# EAGLE design NES_IO_US (EAGLE 7.5.0)
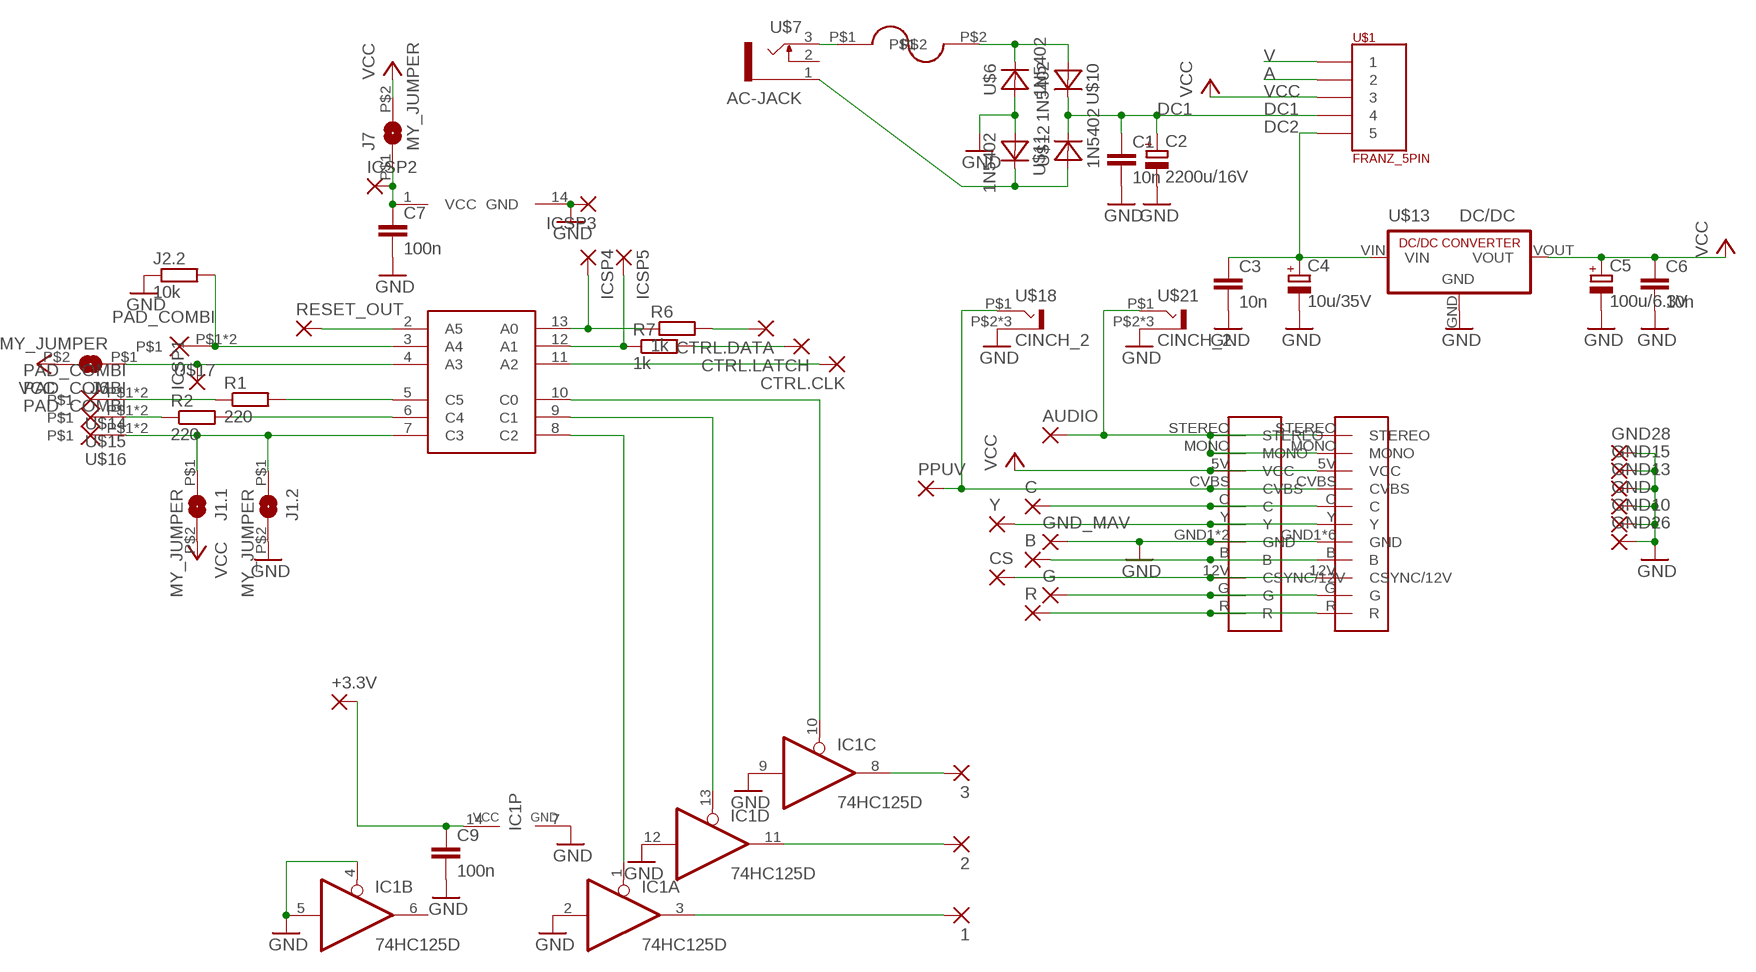
[diagram p0: schematic, sheet 1]

## Parts
1  SMD2  [SMD1,27-2,54]
2  SMD2  [SMD1,27-2,54]
3  SMD2  [SMD1,27-2,54]
+3.3V  SMD2  [SMD1,27-2,54]
AUDIO  SMD2  [SMD1,27-2,54]
B  SMD2  [SMD1,27-2,54]
C  SMD2  [SMD1,27-2,54]
C1  10n  C0805  [Z0805]
C2  2200u/16V  CPOL-EUE5-13  [E5-13]
C3  10n  C0805  [Z0805]
C4  10u/35V  CPOL-EUB  [PANASONIC_B]
C5  100u/6.3V  CPOL-EUD  [PANASONIC_D]
C6  10n  C0805  [Z0805]
C7  100n  C0805  [Z0805]
C9  100n  C0805  [Z0805]
CS  SMD2  [SMD1,27-2,54]
CTRL.CLK  SMD2  [SMD1,27-2,54]
CTRL.DATA  SMD2  [SMD1,27-2,54]
CTRL.LATCH  SMD2  [SMD1,27-2,54]
G  SMD2  [SMD1,27-2,54]
GND  SMD5  [SMD2,54-5,08]
GND10  SMD5  [SMD2,54-5,08]
GND13  SMD5  [SMD2,54-5,08]
GND15  SMD5  [SMD2,54-5,08]
GND26  SMD5  [SMD2,54-5,08]
GND28  SMD5  [SMD2,54-5,08]
GND_MAV  SMD2  [SMD1,27-2,54]
IC1  74HC125D  [SO14]
ICSP1  1,6/0,8  [1,6/0,8]
ICSP2  1,6/0,8  [1,6/0,8]
ICSP3  1,6/0,8  [1,6/0,8]
ICSP4  1,6/0,8  [1,6/0,8]
ICSP5  1,6/0,8  [1,6/0,8]
J1.1  MY_JUMPER  [MYJUMP]
J1.2  MY_JUMPER  [MYJUMP]
J2.2  10k  R0805  [Z0805]
J6  MY_JUMPER  [MYJUMP]
J7  MY_JUMPER  [MYJUMP]
PPUV  SMD2  [SMD1,27-2,54]
R  SMD2  [SMD1,27-2,54]
R1  220  R0805  [Z0805]
R2  220  R0805  [Z0805]
R6  1k  R0805  [Z0805]
R7  1k  R0805  [Z0805]
RESET_OUT  SMD2  [SMD1,27-2,54]
U$1  FRANZ_5PIN  [5X2.22RM4]
U$2  FUSEHOLDER  [FUSEHOLDER]
U$5  PIC16F630_SIMPLE  [PIC16F630]
U$6  1N5402  [DO201]
U$7  AC-JACK  [AC-JACK]
U$10  1N5402  [DO201]
U$11  1N5402  [DO201]
U$12  1N5402  [DO201]
U$13  DC/DC  [RECOM]
U$14  PAD_COMBI  [PAD_COMBI]
U$15  PAD_COMBI  [PAD_COMBI]
U$16  PAD_COMBI  [PAD_COMBI]
U$17  PAD_COMBI  [PAD_COMBI]
U$18  CINCH_2  [CINCH_2]
U$19  GC-MULTIAV  [GC-MULTIAV]
U$20  SNES-MULTIAV2  [SNES-MULTIAV2]
U$21  CINCH_2  [CINCH_2]
Y  SMD2  [SMD1,27-2,54]

## Nets
A: U$1.P$2
AC1A: U$2.P$1 U$7.3
AC1B: U$2.P$2 U$6.C U$10.A
AC2: U$7.1 U$11.C U$12.A
DC1: C1.1 C2.+ U$1.P$4 U$10.C U$12.C
DC2: C3.1 C4.+ U$1.P$5 U$13.VIN
GND: C1.2 C2.- C3.2 C4.- C5.- C6.2 C7.2 C9.2 GND10.1(P) GND13.1(P) GND15.1(P) GND26.1(P) GND28.1(P) GND.1(P) GND_MAV.1(P) IC1.2(A:I) IC1.4(B:OE) IC1.5(B:I) IC1.7(P:GND) IC1.9(C:I) IC1.12(D:I) ICSP3.1(P) J1.2.P$2 J2.2.1 U$5.14(GND) U$6.A U$11.A U$13.GND U$18.P$2(S) U$18.P$3(S) U$18.P$4(S) U$19.GND1(GND) U$19.GND2(GND) U$19.GND3(GND) U$19.GND4(GND) U$19.GND5(GND) U$19.GND6(GND) U$20.GND1(GND) U$20.GND2(GND) U$21.P$2(S) U$21.P$3(S) U$21.P$4(S)
N$1: CS.1(P) U$19.12V(CSYNC/12V) U$20.12V(CSYNC/12V)
N$2: U$19.Y U$20.Y Y.1(P)
N$3: C.1(P) U$19.C U$20.C
N$5: AUDIO.1(P) U$19.MONO U$19.STEREO U$20.MONO U$20.STEREO U$21.P$1(T)
N$6: B.1(P) U$19.B U$20.B
N$8: G.1(P) U$19.G U$20.G
N$9: R.1(P) U$19.R U$20.R
N$11: 3.1(P) IC1.8(C:O)
N$12: J2.2.2 U$5.3(A4) U$17.P$1 U$17.P$2
N$13: R1.2 U$5.5(C5)
N$14: R2.2 U$5.6(C4)
N$15: R1.1 U$14.P$1 U$14.P$2
N$16: R2.1 U$15.P$1 U$15.P$2
N$17: J1.1.P$1 J1.2.P$1 U$5.7(C3) U$16.P$1 U$16.P$2
N$19: CTRL.DATA.1(P) R6.2
N$20: CTRL.LATCH.1(P) R7.2
N$21: CTRL.CLK.1(P) U$5.11(A2)
N$23: IC1.10(C:OE) U$5.10(C0)
N$24: IC1.13(D:OE) U$5.9(C1)
N$25: IC1.1(A:OE) U$5.8(C2)
N$26: +3.3V.1(P) C9.1 IC1.14(P:VCC)
N$27: 1.1(P) IC1.3(A:O)
N$28: 2.1(P) IC1.11(D:O)
N$30: PPUV.1(P) U$18.P$1(T) U$19.CVBS U$20.CVBS
N$31: C7.1 ICSP2.1(P) J7.P$1 U$5.1(VCC)
N$32: ICSP1.1(P) J6.P$1 U$5.4(A3)
N$33: ICSP4.1(P) R6.1 U$5.13(A0)
N$34: ICSP5.1(P) R7.1 U$5.12(A1)
N$35: RESET_OUT.1(P) U$5.2(A5)
V: U$1.P$1
VCC: C5.+ C6.1 J1.1.P$2 J6.P$2 J7.P$2 U$1.P$3 U$13.VOUT U$19.5V(VCC) U$20.5V(VCC)
Unconnected: IC1.6(B:O) U$7.2

## Library data of the parts
1-3 +3.3V AUDIO B C CS CTRL.CLK CTRL.DATA CTRL.LATCH G GND_MAV PPUV R RESET_OUT Y = wirepad:SMD2: SMD PAD
C1 C3 C6 C7 C9 = snes_div:C0805
C2 = resistor:CPOL-EU: POLARIZED CAPACITOR, European symbol
C4 C5 = rcl:CPOL-EU: POLARIZED CAPACITOR, European symbol
GND GND10 GND13 GND15 GND26 GND28 = wirepad:SMD5: SMD PAD
IC1 = 74xx-eu:74*125: Quad bus BUFFER, 3-state
ICSP1-ICSP5 = wirepad:1,6/0,8: THROUGH-HOLE PAD
J1.1 J1.2 J6 J7 = snes_div:MY_JUMPER
J2.2 R1 R2 R6 R7 = snes_div:R0805
U$1 = schnaustlib:FRANZ_5PIN
U$2 = nintendo:FUSEHOLDER
U$5 = snes_div:PIC16F630_SIMPLE
U$6 U$10-U$12 = nintendo:1N5402
U$7 = nintendo:AC-JACK
U$13 = nintendo:DC/DC
U$14-U$17 = MS_Mod:PAD_COMBI
U$18 U$21 = nintendo:CINCH_2
U$19 = nintendo:GC-MULTIAV
U$20 = nintendo:SNES-MULTIAV2

## Board
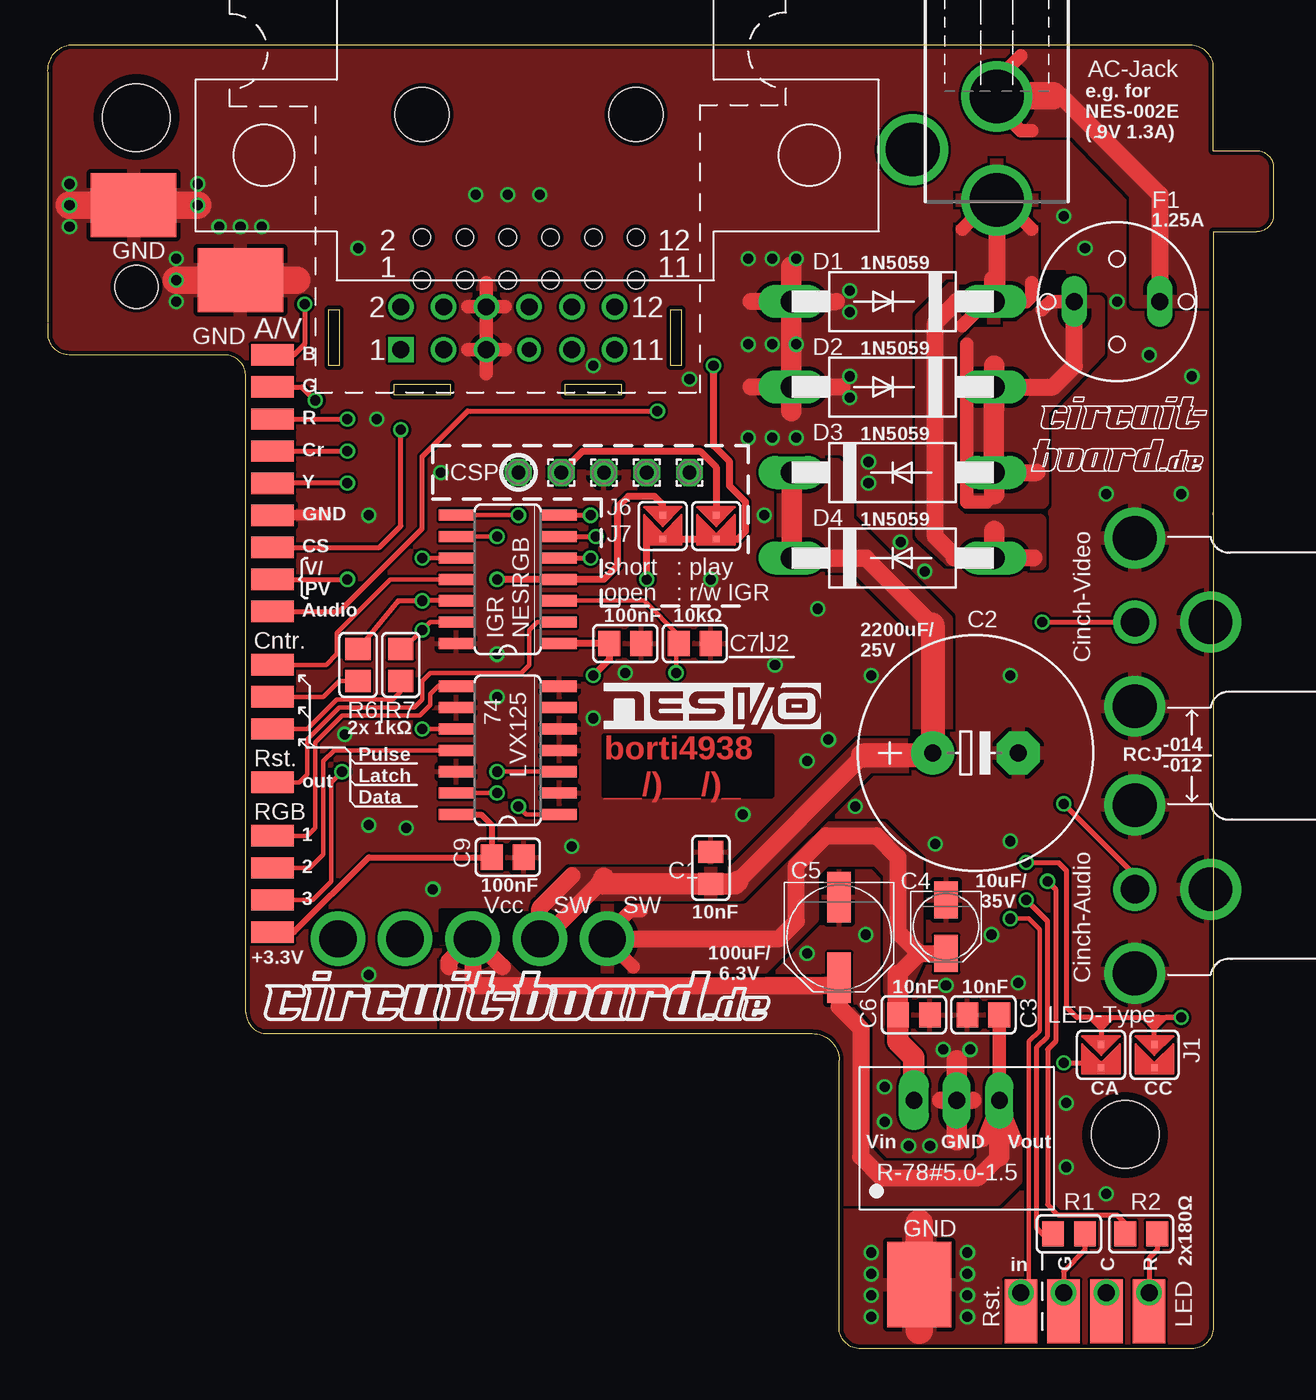
[diagram p1: board, top side]
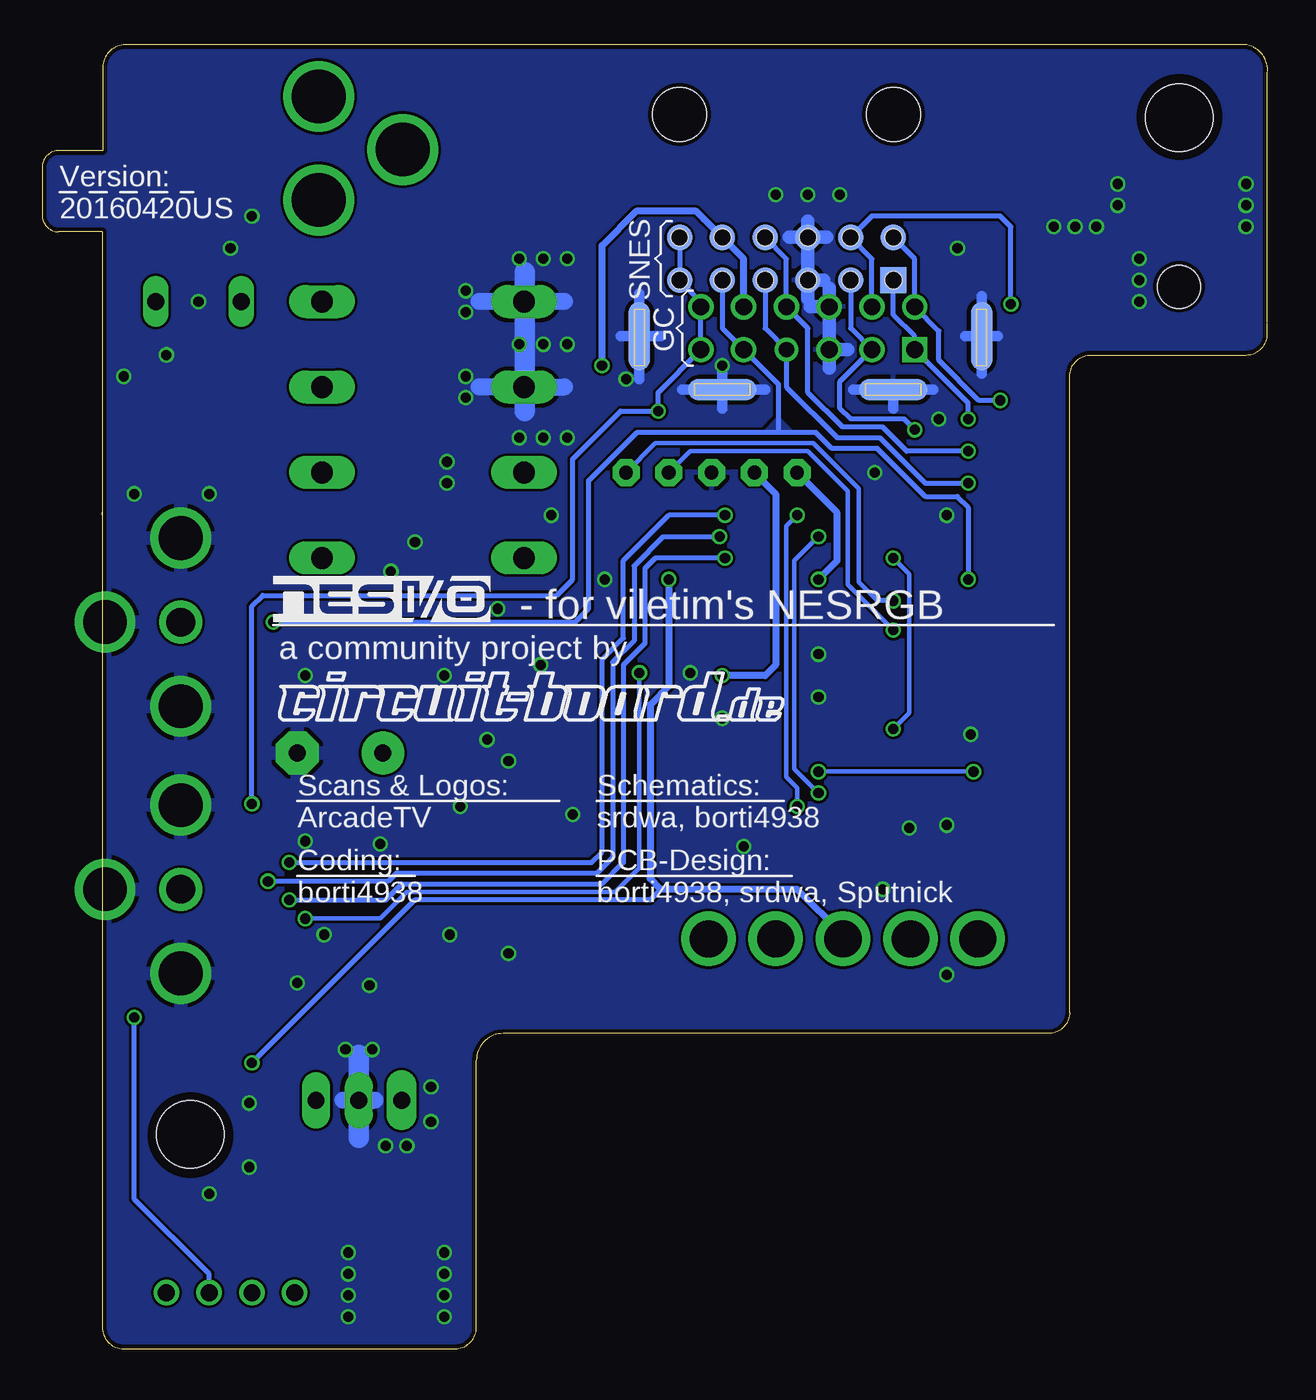
[diagram p2: board, bottom side, seen from below]

Size 72.8 x 77.5 mm. Coordinates in mm from the lower left corner, seen from the top.
Outline: 69.22,49.69 69.22,66.37 71.8,66.37 arc90 72.8,67.37 72.8,70.2 arc90 71.8,71.2 69.2,71.2 69.2,76.13 arc90 67.84,77.5 1.37,77.5 arc90 0.01,75.81 0.01,61.01
Outline: 69.22,49.69 69.22,49.53
Outline: 0.01,60.96 0.01,60.33 arc90 1.28,59.05 10.49,59.05 arc-90 11.76,57.78 11.76,20 arc90 13.03,18.73 45.41,18.73 arc-90 47,17.14 47,1.27 arc90 48.27,0 67.95,0 arc90 69.22,1.27 69.22,49.53
Outline: 69.22,49.53 arc-7 69.22,49.69
Copper layers (1*16): Top 0.035mm / dielectric 1.5mm / Bottom 0.035mm
Design rules "ITEADstudio_DRC": minimum track width 6mil, minimum drill 12mil, track to track 6mil, track to pad 6mil, pad to pad 6mil, via to via 6mil, smd to smd 0mil, copper to edge 10mil, drill to drill 10mil, minimum pad ring 10mil, minimum via ring 6mil, stop-mask expansion 2mil, vias tented up to drill 30mil, thermal gap 10mil
Holes 4 mm at 5.26,73.16 63.99,12.73
Holes 2.54 mm at 5.26,63.11
tRestrict: area 62,10.7 to 66,14.7; area 3.2,71.2 to 7.3,75.2; area 23.3,24.1 to 28.1,26; area 31.4,52.4 to 34.8,53.3; area 12.1,24.3 to 14.6,59.7; area 59.1,62.5 to 60.3,64; area 57.3,13.3 to 58.6,20.6
bRestrict: area 62,10.7 to 66,14.7; area 3.2,71.2 to 7.3,75.2; area 31.4,52.4 to 34.8,53.3

### Footprints (pad centres in the part's own frame; a part is rotated, then mirrored left to right if it is on the bottom)
SMD1,27-2,54 = smd 1.27 x 2.54: 1 0,0
Z0805 = smd 1.3 x 1.5: 1 -0.95,0; 2 0.95,0
E5-13 = drill 1.016 pad 2.54: + -2.54,0 | drill 1.016 pad 2.54 octagon: - 2.54,0
PANASONIC_B = smd 2.2 x 1.4: + 1.6,0; - -1.6,0
PANASONIC_D = smd 3 x 1.4: + 2.4,0; - -2.4,0
SMD2,54-5,08 = smd 2.54 x 5.08: 1 0,0
SO14 = smd 0.66 x 2.032: 1 -3.81,-3.073; 2 -2.54,-3.073; 3 -1.27,-3.073; 4 0,-3.073; 5 1.27,-3.073; 6 2.54,-3.073; 7 3.81,-3.073; 8 3.81,3.073; 9 2.54,3.073; 10 1.27,3.073; 11 0,3.073; 12 -1.27,3.073; 13 -2.54,3.073; 14 -3.81,3.073
1,6/0,8 = drill 0.813 pad 1.6 octagon: 1 0,0
MYJUMP = smd 0.406 x 0.406: P$1 -0.635,0; P$2 0.765,0
5X2.22RM4 = drill 2.22: P$1 -8,0; P$2 -4,0; P$3 0,0; P$4 4,0; P$5 8,0
FUSEHOLDER = drill 1 pad 1.422 long: P$1 -2.54,0; P$2 2.54,0
PIC16F630 = smd 0.66 x 2.032: 1 -3.81,-3.073; 2 -2.54,-3.073; 3 -1.27,-3.073; 4 0,-3.073; 5 1.27,-3.073; 6 2.54,-3.073; 7 3.81,-3.073; 8 3.81,3.073; 9 2.54,3.073; 10 1.27,3.073; 11 0,3.073; 12 -1.27,3.073; 13 -2.54,3.073; 14 -3.81,3.073
DO201 = drill 1.3 long: A 6,0; C -6,0
AC-JACK = drill 3.2 pad 4: 1 0,8.57; 2 5,5.57; 3 0,2.42
RECOM = drill 1 pad 1.676 long: GND 0,0; VOUT 2.54,0 | drill 1 pad 1.778 long: VIN -2.54,0
PAD_COMBI = smd 1.93 x 3.81: P$1 0,0 | drill 1: P$2 0,1.111
CINCH_2 = drill 1.7: P$1 0,-4.5 | drill 2.6: P$2 -5,-4.5; P$3 5,-4.5; P$4 0,0
GC-MULTIAV = drill 1: 5V 15.24,5.08; 12V 7.62,2.54; B 7.62,5.08; C 12.7,5.08; CVBS 15.24,2.54; G 5.08,5.08; GND1 10.16,2.54; GND2 10.16,5.08; MONO 17.78,2.54; STEREO 17.78,5.08 | smd 1.27 x 4.064 bottom: GND3 1.111,3.334; GND6 21.431,3.334 | smd 4.064 x 1.27 bottom: GND4 6.35,0.159; GND5 16.51,0.159 | drill 1 square: R 5.08,2.54 | drill 0.9: Y 12.7,2.54
SNES-MULTIAV2 = smd 1.524 x 1.524 bottom: 5V 15.24,2.54; 12V 7.62,0; B 7.62,2.54; C 12.7,2.54; CVBS 15.24,0; G 5.08,2.54; GND1 10.16,0; GND2 10.16,2.54; MONO 17.78,0; R 5.08,0; STEREO 17.78,2.54; Y 12.7,0 | hole 3.2: 5.08,9.842; 17.78,9.842 | hole 1: 5.08,0; 5.08,2.54; 7.62,2.54; 10.16,2.54; 12.7,2.54; 12.7,0; 10.16,0; 7.62,0; 15.24,2.54; 17.78,2.54; 17.78,0; 15.24,0

### Placement (x,y rotation side)
1  13.34,26.67 270 top
2  13.34,28.57 270 top
3  13.34,30.48 270 top
+3.3V  13.34,24.77 90 top
AUDIO  13.34,43.81 90 top
B  13.34,59.05 90 top
C  13.34,53.34 90 top
C1  39.38,28.57 90 top
C2  55.09,35.4 0 top
C3  51.44,19.84 0 top
C4  53.35,25.08 270 top
C5  47,24.45 270 top
C6  55.57,19.84 180 top
C7  34.3,41.91 0 top
C9  27.31,29.21 0 top
CS  13.34,47.62 90 top
CTRL.CLK  13.34,40.64 270 top
CTRL.DATA  13.34,36.83 270 top
CTRL.LATCH  13.34,38.73 270 top
G  13.34,57.15 90 top
GND  5.09,68.58 90 top
GND10  51.13,3.81 180 top
GND13  52.4,3.81 0 top
GND15  11.44,62.87 90 top
GND26  11.44,64.14 90 top
GND28  5.09,67.31 90 top
GND_MAV  13.34,49.53 270 top
IC1  27.31,35.56 90 top
ICSP1  27.95,52.07 0 top
ICSP2  30.49,52.07 0 top
ICSP3  33.03,52.07 0 top
ICSP4  35.57,52.07 0 top
ICSP5  38.11,52.07 0 top
J1.1  62.56,17.46 270 top
J1.2  65.73,17.46 270 top
J2.2  38.43,41.91 180 top
J6  36.52,48.9 270 top
J7  39.7,48.9 270 top
PPUV  13.34,45.72 90 top
R  13.34,55.24 90 top
R1  60.65,6.83 180 top
R2  64.94,6.83 180 top
R6  20.96,40.64 270 top
R7  18.42,40.64 270 top
RESET_OUT  13.34,33.66 90 top
U$1  25.22,24.36 0 top
U$2  63.51,62.23 180 top
U$3  [NESIO-LOGO]  33.03,36.83 0 top
U$4  [NESIO-LOGO]  59.06,43.18 0 bottom
U$5  27.31,45.72 90 top
U$6  50.17,57.15 180 top
U$7  56.36,76.83 180 top
U$10  50.17,52.07 0 top
U$11  50.17,62.23 180 top
U$12  50.17,46.99 0 top
U$13  53.98,14.76 0 top
U$14  60.33,2.22 0 top
U$15  65.41,2.22 0 top
U$16  62.87,2.22 0 top
U$17  57.79,2.22 0 top
U$18  69.06,43.18 270 top
U$19  15.88,56.83 0 top
U$20  17.15,63.5 0 top
U$21  69.06,27.3 270 top
Y  13.34,51.44 90 top

### Tracks (layer width: path | path; a pad name or v marks a point on that pad's centre or on a via)
AC1A
  Top 0.813: 56.21,74.61 56.21,75.25 | 56.21,75.25 57.79,76.83 | 56.21,75.25 55.73,74.77 55.73,74.45 57.79,72.39 58.43,72.39
  Top 1.016: U$7.3 60.17,74.45 66.05,68.58 U$2.P$1
  Top 1.626: 59.7,74.45 56.21,74.45 56.21,74.61 56.21,74.77 56.05,74.61 56.05,74.45
  pour Top: 58.11,72.39 58.11,77.47 69.38,77.47 72.87,73.98 72.87,62.23 64.62,62.23 64.62,68.58 60.97,72.39
AC1B
  Top 0.813: U$2.P$2 59.54,62.23 59.06,61.75 | 54.59,59.69 54.59,50.32 55.73,50.32 56.21,50.8
  Top 1.016: U$6.C 56.21,57.15 59.7,57.15 60.97,58.42 60.97,61.75 | 56.21,52.07 58.75,52.07
  Top 1.219: U$6.C U$10.A | 56.21,52.07 56.21,50.8 | 56.21,55.88 56.21,57.15 56.21,58.42
  pour Top (rank 2): 54.3,50.32 59.06,50.32 59.06,55.72 62.4,59.21 62.4,62.23 59.54,62.23 57.63,60.64 55.09,60.64 54.3,59.85
AC2
  Top 0.813: 58.43,66.52 56.36,68.58 56.13,68.34 | 56.13,68.34 54.3,66.52 | U$7.1 56.13,68.27 56.13,68.34 | 56.21,62.23 58.11,62.23 58.43,62.55 58.43,63.34 | 54.3,60.8 55.89,62.39
  Top 1.016: U$7.1 56.36,62.23 56.21,62.23 U$11.C 53.98,62.23 52.71,60.96 52.71,48.26 53.98,46.99 U$12.A | 58.59,46.99 53.82,46.99
  Top 1.219: 56.21,62.23 56.21,63.5 | 56.21,46.99 56.21,48.58
  pour Top: 57.16,70.33 55.57,70.33 54.3,69.06 54.3,63.66 51.92,61.28 51.92,48.42 53.82,46.67 58.9,46.67 58.9,49.21 54.3,49.21 53.67,49.85 53.67,60.17 54.78,61.28 57.16,61.28 58.43,62.55 58.43,69.06
DC1
  Top 0.813: 29.22,26.35 29.54,26.67
  Top 1.016: U$12.C 48.59,46.99 52.55,43.02 | 48.43,35.24 40.97,27.78 | U$1.P$4 | 32.71,27.62 29.22,24.13 29.22,26.19 31.12,28.1
  Top 1.219: U$10.C U$12.C
  Top 1.27: 33.03,27.94 33.03,27.62 C1.1 40.81,27.62 40.97,27.78
  Top 1.422: 52.55,43.02 C2.+ | 52.55,35.24 48.43,35.24
  pour Top: 43.66,46.51 43.66,52.55 46.84,52.55 47.47,51.91 47.47,49.21 53.35,43.34 53.35,35.88 52.71,34.61 48.74,34.61 41.12,26.99 32.23,26.99 30.17,24.92 30.17,24.45 27.95,24.45 27.95,25.08 31.12,28.26 40.65,28.26 48.27,35.88 51.13,35.88 51.76,36.51 51.76,42.7 47.95,46.51
DC2
  Top 0.406: 53.36,23.5 C4.+
  Top 0.813: 35.25,26.04 34.62,26.04 33.03,24.45 34.77,22.7
  Top 1.016: U$1.P$5 43.42,24.36 44.46,25.4 44.46,28.73 46.2,30.48 49.22,30.48 50.49,29.21 50.49,24.77 51.76,23.5 | 51.76,23.5 53.34,23.5 C4.+ | 50.49,22.23 51.76,23.5 | 50.49,19.05 C3.1
  Top 1.219: C3.1 50.49,22.23
  Top 1.27: U$13.VIN 51.44,17.3 50.49,18.26 50.49,19.05
  pour Top (rank 2): 42.55,22.7 33.03,22.7 33.03,26.19 41.28,26.19 46.05,30.96 49.54,30.96 51.6,28.89 51.6,23.02 50.81,21.27 50.01,21.27 50.01,28.26 49.22,29.05 46.2,29.05 45.41,28.26 45.41,25.56
GND  (via drill 0.6)
  Top 0.61: GND_MAV.1 16.52,49.53
  Top 0.813: U$19.GND2 U$19.GND1 | U$19.GND1 26.04,57.94 | 24.93,59.37 U$19.GND1 | U$19.GND1 27.15,59.37 | 24.93,61.91 27.15,61.91 | 26.04,63.34 U$19.GND1
  Top 1.016: 10.17,64.14 GND26.1 | 41.76,57.15 44.14,57.15 47.16,57.15 | 46.84,62.23 44.14,62.23 41.76,62.23 | 53.03,14.76 U$13.GND 54.94,14.76
  Top 1.219: 44.14,64.29 44.14,62.23 44.14,57.15 44.14,55.72 | 53.98,17.14 U$13.GND 53.98,12.38
  Top 1.626: v1.28,67.94 v8.9,67.94 | v7.63,63.5 14.77,63.5 | 51.76,7.46 51.76,1.11
  Bottom 0.305: U$20.GND2 27.31,65.25
  Bottom 0.61: U$19.GND5 29.85,56.99 | 34.77,56.99 U$19.GND5 | U$19.GND5 32.39,55.88 | U$19.GND5 v32.39,58.42 | 19.85,56.99 U$19.GND4 | U$19.GND4 22.23,55.88 | U$19.GND3 16.99,62.55 | 16.99,57.94 U$19.GND3 | U$19.GND3 17.95,60.17 | U$19.GND3 16.04,60.17 | U$19.GND6 38.43,60.17 | 36.04,60.17 U$19.GND6 | U$19.GND6 37.31,62.71 | U$19.GND6 37.31,57.63 | U$19.GND4 24.61,56.99
  Bottom 0.813: U$19.GND2 U$19.GND1 | 27.31,62.39 U$20.GND1 U$20.GND2 27.31,66.99 | 26.36,63.5 27.15,63.5 | 26.2,66.04 28.42,66.04 | 24.93,59.37 U$19.GND1 | 26.04,58.26 U$19.GND1 | 27.15,61.91 U$19.GND2 | 26.04,63.02 U$19.GND2
  Bottom 1.016: 41.76,62.23 44.14,62.23 46.84,62.23 | 46.84,57.15 44.14,57.15 41.76,57.15 | 53.03,14.76 U$13.GND 54.94,14.76
  Bottom 1.219: 44.14,63.98 44.14,62.23 44.14,57.15 44.14,55.72 | 53.98,17.46 U$13.GND 53.98,12.54
  other vias: 26.68,41.27 31.12,29.84 11.44,66.67 10.17,66.67 8.9,69.22 7.63,64.77 7.63,62.23 1.28,69.22 1.28,66.67 12.71,66.67 19.06,22.23 45.73,43.97 22.87,27.3 45.09,23.5 48.9,5.71 48.9,4.45 48.9,3.17 48.9,1.91 54.62,5.71 54.62,4.45 54.62,3.17 54.62,1.91 60.49,14.61 62.87,9.21 26.68,38.73 46.36,36.2 42.55,49.53 43.03,64.77 44.46,64.77 41.6,64.77 47.63,61.59 52.08,46.2 52.71,30 41.28,31.75 67.95,57.78 67.32,50.8 53.35,21.59 57.63,21.75 52.4,12.06 57.16,40.01 43.03,59.69 41.6,59.69 19.06,49.53 49.7,15.56 47.63,62.87 48.59,24.61 51.13,12.06 19.06,31.11 18.42,65.41 47.63,56.52 47.63,57.78 34.3,40.16 60.33,67.31 45.09,34.92 44.46,59.69 38.11,57.63 50.65,47.94 19.53,55.24 63.51,62.23 65.41,59.05 61.6,65.41 32.39,37.47 62.87,50.8 57.16,30.16 48.9,40.01 48.74,52.7 47.95,32.23 48.74,51.44 21.28,30.96 43.19,40.64 60.49,10.79 27.31,68.58 25.41,68.58 56.05,24.61 49.7,13.49 53.19,17.78 54.78,17.78 29.22,68.58 17.63,36.51 39.38,45.72 43.03,54.13 41.6,54.13 44.46,54.13 23.34,52.07
  pour Top (rank 5): 0.01,48.26 0.01,71.12 16.52,71.12 16.52,48.26
  pour Top (rank 5): 48.27,7.62 55.89,7.62 55.89,0 48.27,0
  pour Bottom (rank 5): 59.7,38.1 55.09,38.1 55.09,33.02 59.7,33.02
  pour Top (rank 5): 59.7,38.1 55.09,38.1 55.09,33.02 59.7,33.02
  pour Bottom: 62.24,50.48 69.22,50.64 69.22,20.16 62.24,20.16
  pour Top: 62.24,50.48 69.22,50.48 69.22,20.16 62.24,20.16
  pour Top (rank 6): 0.01,0 69.22,0 69.22,66.36 72.87,66.36 72.87,77.63 0.01,77.63
  pour Bottom (rank 6): 0.01,0 69.22,0 69.22,66.36 72.87,66.36 72.87,77.63 0.01,77.63
N$1  (via drill 0.6)
  Top 0.305: CS.1 19.69,47.62 20.96,48.9 v20.96,54.61
  Bottom 0.305: U$20.12V 24.77,60.64 U$19.12V 25.41,57.47 25.41,55.88 24.77,55.24 21.6,55.24 v20.96,54.61
N$2  (via drill 0.6)
  Top 0.305: v17.79,51.44 Y.1
  Bottom 0.305: U$20.Y 29.85,60.64 U$19.Y 28.58,57.15 25.57,54.13 23.03,54.13 20.33,51.44 v17.79,51.44
N$3  (via drill 0.6)
  Top 0.305: C.1 v17.79,53.34
  Bottom 0.305: U$20.C 28.58,64.77 U$19.C 27.31,60.64 27.31,56.83 25.25,54.77 22.87,54.77 21.44,53.34 v17.79,53.34
N$5  (via drill 0.6)
  Top 0.305: v36.2,55.72 24.93,55.72 22.23,53.02 22.23,48.74 17.31,43.81 AUDIO.1 | U$21.P$1 64.56,28.15 v60.33,32.38
  Bottom 0.305: U$20.STEREO U$20.MONO 33.66,62.23 U$19.STEREO U$19.MONO 36.2,56.83 v36.2,55.72 38.43,55.72 41.28,52.86 41.28,45.72 42.24,44.77 59.7,44.77 60.33,44.13 v60.33,32.38
N$6  (via drill 0.6)
  Top 0.305: B.1 14.61,59.05 15.25,59.69 v15.25,62.07
  Bottom 0.305: U$19.B 23.5,64.77 U$20.B 23.5,67.31 15.88,67.31 15.25,66.67 v15.25,62.07
N$8  (via drill 0.6)
  Top 0.305: G.1 15.09,57.15 v15.88,56.36
  Bottom 0.305: U$20.G 20.96,64.77 U$19.G 19.53,60.48 19.53,58.74 17.15,56.36 v15.88,56.36
N$9  (via drill 0.6)
  Top 0.305: R.1 v17.79,55.24
  Bottom 0.305: U$20.R 22.23,61.44 20.96,60.17 U$19.R 17.79,56.2 v17.79,55.24
N$11
  Top 0.254: 3.1 15.41,30.48 15.88,30.96 15.88,36.04 17.47,37.62 22.07,37.62 22.71,38.26 22.71,38.89 23.19,39.37 IC1.8
N$12  (via drill 0.6)
  Top 0.254: 37.16,41.91 J2.2.2 | 37.16,41.91 J2.2.2 | U$5.3 35.41,44.45 37.47,42.39 J2.2.2 | U$17.P$2 58.27,3.65 58.27,18.26 58.9,18.89 58.9,24.92 58.27,25.56 v57.16,25.56 | v37.31,40.16 37.31,41.75 J2.2.2
  Top 0.305: U$17.P$1 U$17.P$2
  Bottom 0.254: v57.16,25.56 52.71,25.56 51.13,27.15 38.74,27.15 37.31,28.57 v37.31,40.16
N$13  (via drill 0.6)
  Top 0.305: U$5.5 v32.23,46.99 | R1.2 59.06,6.83 58.75,7.14 58.75,17.94 59.38,18.57 59.38,25.4 v58.11,26.67
  Bottom 0.305: v32.23,46.99 36.36,46.99 37,46.35 37,41.91 38.27,40.64 38.27,28.89 39.54,27.62 51.44,27.62 52.4,26.67 v58.11,26.67
N$14  (via drill 0.6)
  Top 0.305: U$5.6 v32.55,48.26 | R2.2 63.99,7.46 63.51,7.94 60.02,7.94 59.38,8.57 59.38,17.78 59.86,18.26 59.86,27.3 v59.38,27.78
  Bottom 0.305: v32.55,48.26 35.89,48.26 37.63,46.51 37.63,42.07 38.9,40.8 38.9,29.21 39.85,28.26 51.76,28.26 52.24,27.78 v59.38,27.78
N$15
  Top 0.305: U$14.P$1 U$14.P$2 60.33,4.6 61.6,5.87 R1.1
N$16
  Top 0.305: U$15.P$1 U$15.P$2 65.41,5.4 65.89,5.87 R2.1
N$17  (via drill 0.6)
  Top 0.305: U$5.7 v32.23,49.53 | U$16.P$1 U$16.P$2 | 62.56,19.05 J1.1.P$1 | 65.41,18.41 J1.2.P$1 65.73,19.05 | 62.56,19.05 61.92,19.68 | 65.73,19.05 65.1,19.68 | 61.92,19.68 62.87,19.68 | 62.87,19.68 63.19,19.68 | 63.19,19.68 62.56,19.05 | 62.56,19.05 62.56,19.21 62.24,19.53 62.56,19.53 62.71,19.37 62.71,19.53 62.87,19.68 | 63.19,19.68 65.1,19.68 | 65.1,19.68 65.25,19.68 | 65.25,19.68 65.73,19.68 | 66.05,19.68 v67.32,19.68 66.37,19.68 65.73,19.05 | 65.73,19.05 65.73,19.37 66.05,19.68 | 66.05,19.68 65.73,19.68 | 65.73,19.68 65.57,19.53 65.41,19.53 65.25,19.68 | 61.92,19.68 61.13,19.68 60.49,20.32 60.49,28.42 60.02,28.89 v58.11,28.89
  Bottom 0.305: v32.23,49.53 35.57,49.53 38.27,46.83 38.27,42.23 39.54,40.96 39.54,29.53 40.17,28.89 v58.11,28.89 | U$16.P$2 62.87,4.45 67.32,8.89 v67.32,19.68
N$19
  Top 0.254: CTRL.DATA.1 15.41,36.83 17.15,38.58 20.49,38.58 20.96,39.05 R6.2
N$20
  Top 0.254: CTRL.LATCH.1 16.36,38.73 17.31,39.69 R7.2
N$21
  Top 0.254: U$5.11 20.33,45.72 17.15,42.55 17.15,41.27 16.52,40.64 CTRL.CLK.1
N$23  (via drill 0.6)
  Top 0.254: 24.3,36.83 IC1.10 v22.23,36.83 | U$5.10 v22.23,46.99
  Bottom 0.254: v22.23,46.99 21.28,46.04 21.28,37.78 v22.23,36.83
N$24  (via drill 0.6)
  Top 0.254: U$5.9 v26.68,48.26 | v26.68,33.02 IC1.13
  Bottom 0.254: v26.68,48.26 28.11,46.83 28.11,34.45 v26.68,33.02
N$25  (via drill 0.6)
  Top 0.254: U$5.8 v27.95,49.53 | IC1.1 28.42,31.75 v27.95,32.23
  Bottom 0.254: v27.95,49.53 28.58,48.9 28.58,33.97 27.95,33.34 v27.95,32.23
N$26
  Top 0.254: C9.1
  Top 0.356: C9.1 26.36,31.11 25.73,31.75 IC1.14 | C9.1 19.06,29.21 14.61,24.77 +3.3V.1
N$27  (via drill 0.6)
  Top 0.254: 1.1 15.72,26.67 16.84,27.78 16.84,33.66 v17.47,34.29 | v26.68,34.29 IC1.3
  Bottom 0.254: v17.47,34.29 v26.68,34.29
N$28
  Top 0.254: IC1.11 16.99,35.56 16.36,34.92 16.36,29.37 15.57,28.57 2.1
N$30  (via drill 0.6)
  Top 0.305: v59.06,43.18 U$18.P$1 | PPUV.1 v17.79,45.72
  Bottom 0.305: U$20.CVBS 32.39,60.64 U$19.CVBS 29.06,57.31 29.06,54.45 | 29.06,54.45 26.84,54.45 25.88,53.5 23.19,53.5 20.33,50.64 18.42,50.64 17.79,50.01 v17.79,45.72 | 29.06,54.45 37.47,54.45 40.33,51.59 40.33,43.97 41.12,43.18 v59.06,43.18
  pour Bottom: 29.06,55.24 28.27,54.45 29.85,54.45
N$31  (via drill 0.6)
  Top 0.406: U$5.1 C7.1 33.35,40.95 v32.39,40.01 | ICSP2.1 31.76,53.34 38.74,53.34 39.7,52.39 J7.P$1
  Bottom 0.406: ICSP2.1 29.22,50.8 29.22,40.64 29.85,40.01 v32.39,40.01
N$32  (via drill 0.6)
  Top 0.406: v26.68,45.72 U$5.4 33.03,45.72 33.82,46.51 33.82,50.01 34.46,50.64 36.04,50.64 36.52,50.16 J6.P$1
  Bottom 0.406: v26.68,45.72 25.57,46.83 25.57,49.69 ICSP1.1
N$33  (via drill 0.6)
  Top 0.254: R6.1 21.76,42.23 v22.23,42.7 22.71,43.18 U$5.13
  Bottom 0.254: v22.23,42.7 24.93,45.4 24.93,50.96 27.31,53.34 34.3,53.34 ICSP4.1
N$34  (via drill 0.6)
  Top 0.305: R7.1 20.8,44.45 v22.23,44.45 U$5.12
  Bottom 0.254: 23.19,44.45 24.3,45.56 24.3,51.12 27,53.82 36.36,53.82 ICSP5.1
  Bottom 0.305: v22.23,44.45 23.19,44.45
N$35
  Top 0.254: U$5.2 29.06,43.18 28.58,42.7 28.58,40.64 28.11,40.16 22.71,40.16 22.23,39.69 22.23,38.58 21.76,38.1 17.31,38.1 15.41,36.2 15.41,34.13 14.93,33.66 RESET_OUT.1
VCC  (via drill 0.6)
  Top 0.305: v60.33,16.99 62.53,16.99 J1.1.P$2
  Top 0.406: v39.54,58.42 39.54,53.66 40.49,52.7 40.49,51.28 41.44,50.32 41.44,48.58 40.97,48.1 39.72,48.1 J7.P$2 J6.P$2 36.49,48.1 35.73,48.1 35.57,47.94 v35.57,45.72
  Top 0.813: U$13.VOUT 56.52,20 | U$13.VOUT 55.57,12.38 | U$13.VOUT 57.48,12.38
  Top 1.016: 56.52,20 C6.1 | U$1.P$3 25.22,24.32 25.25,24.29 | 25.25,24.29 25.25,21.59 46.54,21.59 C5.+ 47,20.32 48.27,19.05 48.27,11.43 49.54,10.16 55.25,10.16 56.52,11.43 | 25.25,24.29 25.09,24.29 23.82,23.02 23.82,22.7 | 25.25,24.45 27,22.7
  Top 1.219: 56.52,11.43 U$13.VOUT
  Bottom 0.305: 36.04,27.3 36.68,26.67 50.65,26.67 v60.33,16.99
  Bottom 0.406: U$1.P$3 25.22,24.58 27.95,27.3 36.04,27.3 36.68,27.94 36.68,38.26 35.57,39.37 v35.57,45.72 | v39.54,58.42 39.54,65.56 37.47,67.63 33.98,67.63 U$20.5V | U$20.5V 33.5,67.15 | U$19.5V 31.12,64.77 U$20.5V
  pour Top (rank 3): 57.48,12.38 55.57,12.38 55.57,11.27 55.09,10.79 49.54,10.79 48.43,11.91 48.43,19.05 46.2,21.75 28.27,21.59 26.36,23.5 26.36,24.13 25.57,24.92 23.66,24.92 23.66,18.73 47,18.73 47,8.89 56.36,8.89 57.48,10

### Text on the board
Top: borti4938 / __/)__/)_
tNames: AC-Jack | e.g. for / NES-002E / ( 9V 1.3A) | ~ | F1 | 1.25A | GND | D1 | 1N5059 | GND | A/V | B | D2 | 1N5059 | G | R | D3 | 1N5059 | Cr | ICSP | Y | J6 | GND | D4 | 1N5059 | J7 | CS | V/ / PV | short / open | : play / : r/w IGR | Audio | 100nF | 10kΩ | C2 | Cntr. | IGR / NESRGB | C7 | J2 | 2200uF/ / 25V | Cinch-Video | 74 / LVX125 | 2x | R6|R7 | 1kΩ | Rst. | Pulse | RCJ | Latch | -014 / -012 | out | Data | RGB | 1 | C9 | 2 | C1 | C5 | 100nF | C4 | 3 | Vcc | SW | SW | 10nF | 10uF/ / 35V | +3.3V | 100uF/ / 6.3V | Cinch-Audio | 10nF | 10nF | C6 | C3 | LED-Type | J1 | CA | CC | Vin | GND | Vout | R-78#5.0-1.5 | R1 | R2 | GND | in | G | C | R | 2x180Ω | Rst. | LED
bNames: SNES | Version: / 20160420US | GC | - for viletim's NESRGB | a community project by | Schematics: / srdwa, borti4938 | Scans & Logos: / ArcadeTV | PCB-Design: / borti4938, srdwa, Sputnick | Coding: / borti4938
tStop: b | o | r | t | i | 4 | 9 | 3 | 8 | _ | _ | / | ) | _ | _ | / | ) | _